# Altium schematic sheet Sch_Control.SchDoc
size A4; ENG_APP_DATE: --/--/--; DSN_APP_DATE: --/--/--; CHK_APP_DATE: --/--/--; CompanyName: Universidade Federal de Santa Maria; Organization: Universidade Federal de Santa Maria; Address1: Av. Roraima 1000; Address2: Camobi; Address3: Santa Maria - RS; Address4: Brasil; SheetNumber: 6; SheetTotal: 6
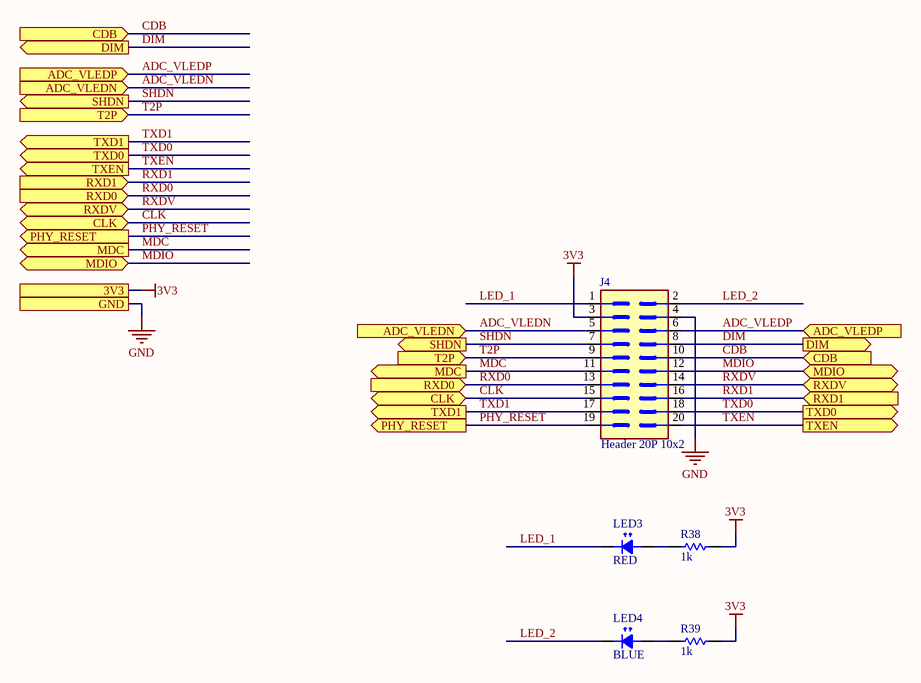
[diagram p0: Sch_Control.SchDoc]

## Parts
J4  Header 20P 10x2  [CON_PTH_20P_HEADER_10x2_2.54mm_FEMALE]
LED3  RED  [LED_SMD_0603]
LED4  BLUE  [LED_SMD_0603]
R38  1k  [RES_SMD_0603]
R39  1k  [RES_SMD_0603]

## Ports
3V3, ADC_VLEDN (in), ADC_VLEDP (in), CDB (in), CLK (bidir), DIM (out), GND, MDC (out), MDIO (bidir), PHY_RESET (out), RXD0 (in), RXD1 (in), RXDV (bidir), SHDN (out), T2P (in), TXD0 (out), TXD1 (out), TXEN (out)

## Nets
3V3: J4.3 R38.1 R39.1 ; port 3V3
GND: J4.4 ; port GND
ADC_VLEDN: J4.5 ; port ADC_VLEDN
ADC_VLEDP: J4.6 ; port ADC_VLEDP
CDB: J4.10 ; port CDB
CLK: J4.15 ; port CLK
DIM: J4.8 ; port DIM
LED_1: J4.1 LED3.K
LED_2: J4.2 LED4.K
MDC: J4.11 ; port MDC
MDIO: J4.12 ; port MDIO
PHY_RESET: J4.19 ; port PHY_RESET
RXD0: J4.13 ; port RXD0
RXD1: J4.16 ; port RXD1
RXDV: J4.14 ; port RXDV
SHDN: J4.7 ; port SHDN
T2P: J4.9 ; port T2P
TXD0: J4.18 ; port TXD0
TXD1: J4.17 ; port TXD1
TXEN: J4.20 ; port TXEN
NetLED3_A: LED3.A R38.2
NetLED4_A: LED4.A R39.2

## Notes on the sheet
- Engineers
- Title
- Size:
- Date:
- A4
- Number:
- Time:
- Revision:
- Sheet
- of
- File:

## Library data of the parts
J4 = CON_PTH_HEADER_20P_10x2: 10x2 20P PTH pin header - Generic
LED3 LED4 = LED_SMD: LED SMD - Generic
R38 R39 = RES_SMD: Resistor SMD - Generic